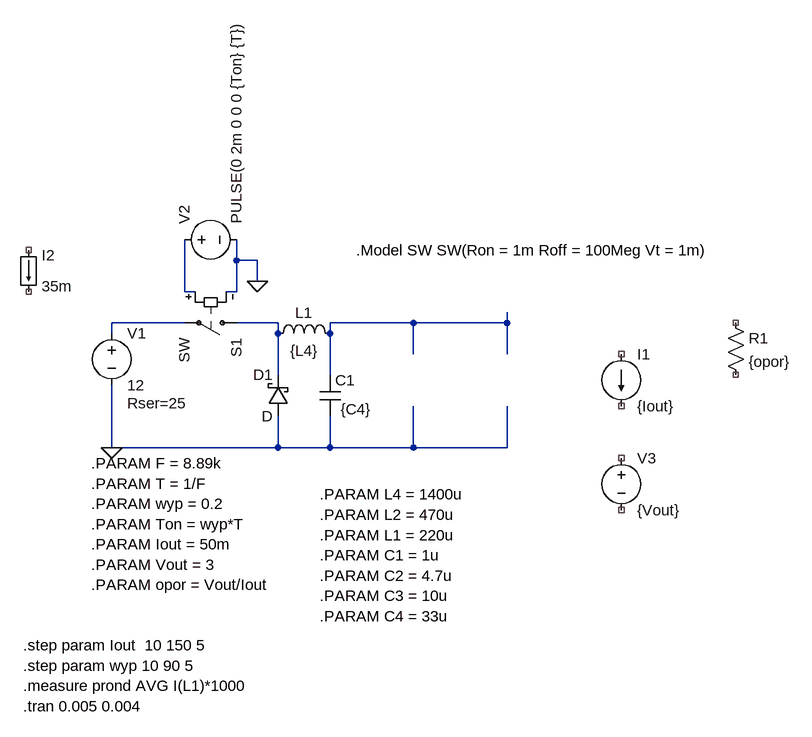
[diagram p0: schematic stepdown.asc]
stepdown.asc, the LTspice schematic file:
Version 4
SHEET 1 1048 724
WIRE 176 32 176 0
WIRE 208 32 176 32
WIRE 208 64 208 32
WIRE 96 80 96 0
WIRE 112 80 96 80
WIRE 176 80 176 32
WIRE 176 80 160 80
WIRE 96 128 -16 128
WIRE 240 128 176 128
WIRE 448 128 320 128
WIRE 592 128 592 112
WIRE 592 128 448 128
WIRE -16 144 -16 128
WIRE 240 144 240 128
WIRE 320 144 320 128
WIRE 448 176 448 128
WIRE 592 176 592 128
WIRE 240 208 240 144
WIRE 320 208 320 144
WIRE -16 320 -16 224
WIRE 240 320 240 272
WIRE 240 320 -16 320
WIRE 320 320 320 272
WIRE 320 320 240 320
WIRE 448 320 448 256
WIRE 448 320 320 320
WIRE 592 320 592 256
WIRE 592 320 448 320
FLAG -16 320 0
FLAG 208 64 0
SYMBOL voltage -16 128 R0
WINDOW 123 0 0 Left 0
WINDOW 39 24 124 Left 2
SYMATTR SpiceLine Rser=25
SYMATTR InstName V1
SYMATTR Value 12
SYMBOL cap 304 208 R0
WINDOW 3 32 53 Left 2
SYMATTR Value {C4}
SYMATTR InstName C1
SYMBOL ind 224 160 R270
WINDOW 0 32 56 VTop 2
WINDOW 3 5 56 VBottom 2
SYMATTR InstName L1
SYMATTR Value {L4}
SYMBOL schottky 256 272 R180
WINDOW 0 24 64 Left 2
WINDOW 3 24 0 Left 2
SYMATTR InstName D1
SYMBOL voltage 80 0 R270
WINDOW 123 0 0 Left 0
WINDOW 39 0 0 Left 0
SYMATTR InstName V2
SYMATTR Value PULSE(0 2m 0 0 0 {Ton} {T})
SYMBOL load -160 16 R0
WINDOW 123 0 0 Left 0
WINDOW 39 0 0 Left 0
SYMATTR InstName I2
SYMATTR Value 35m
SYMBOL sw 192 128 R90
SYMATTR InstName S1
SYMBOL current 768 176 R0
WINDOW 123 0 0 Left 0
WINDOW 39 0 0 Left 0
SYMATTR InstName I1
SYMATTR Value {Iout}
SYMBOL voltage 768 320 R0
WINDOW 123 0 0 Left 0
WINDOW 39 24 124 Left 2
SYMATTR InstName V3
SYMATTR Value {Vout}
SYMBOL res 928 112 R0
SYMATTR InstName R1
SYMATTR Value {opor}
TEXT -48 344 Left 2 !.PARAM F = 8.89k\n.PARAM T = 1/F\n.PARAM wyp = 0.2\n.PARAM Ton = wyp*T\n.PARAM Iout = 50m\n.PARAM Vout = 3\n.PARAM opor = Vout/Iout
TEXT 360 16 Left 2 !.Model SW SW(Ron = 1m Roff = 100Meg Vt = 1m)
TEXT 304 392 Left 2 !.PARAM L4 = 1400u\n.PARAM L2 = 470u\n.PARAM L1 = 220u\n.PARAM C1 = 1u\n.PARAM C2 = 4.7u\n.PARAM C3 = 10u\n.PARAM C4 = 33u
TEXT -152 624 Left 2 !.step param Iout  10 150 5\n.step param wyp 10 90 5\n.measure prond AVG I(L1)*1000\n.tran 0.005 0.004

The netlist it stands for:
* stepdown.asc
V1 N002 0 12 Rser=25
C1 N004 0 {C4}
L1 N003 N004 {L4}
D1 0 N003 D
V2 N001 0 PULSE(0 2m 0 0 0 {Ton} {T})
I2 NC_01 NC_02 35m
S1 N003 N002 N001 0 SW
I1 NC_03 NC_04 {Iout}
V3 NC_05 NC_06 {Vout}
R1 NC_07 NC_08 {opor}
.model D D
.lib standard.dio
.PARAM F = 8.89k
.PARAM T = 1/F
.PARAM wyp = 0.2
.PARAM Ton = wyp*T
.PARAM Iout = 50m
.PARAM Vout = 3
.PARAM opor = Vout/Iout
.Model SW SW(Ron = 1m Roff = 100Meg Vt = 1m)
.PARAM L4 = 1400u
.PARAM L2 = 470u
.PARAM L1 = 220u
.PARAM C1 = 1u
.PARAM C2 = 4.7u
.PARAM C3 = 10u
.PARAM C4 = 33u
.step param Iout  10 150 5
.step param wyp 10 90 5
.measure prond AVG I(L1)*1000
.tran 0.005 0.004
.backanno
.end